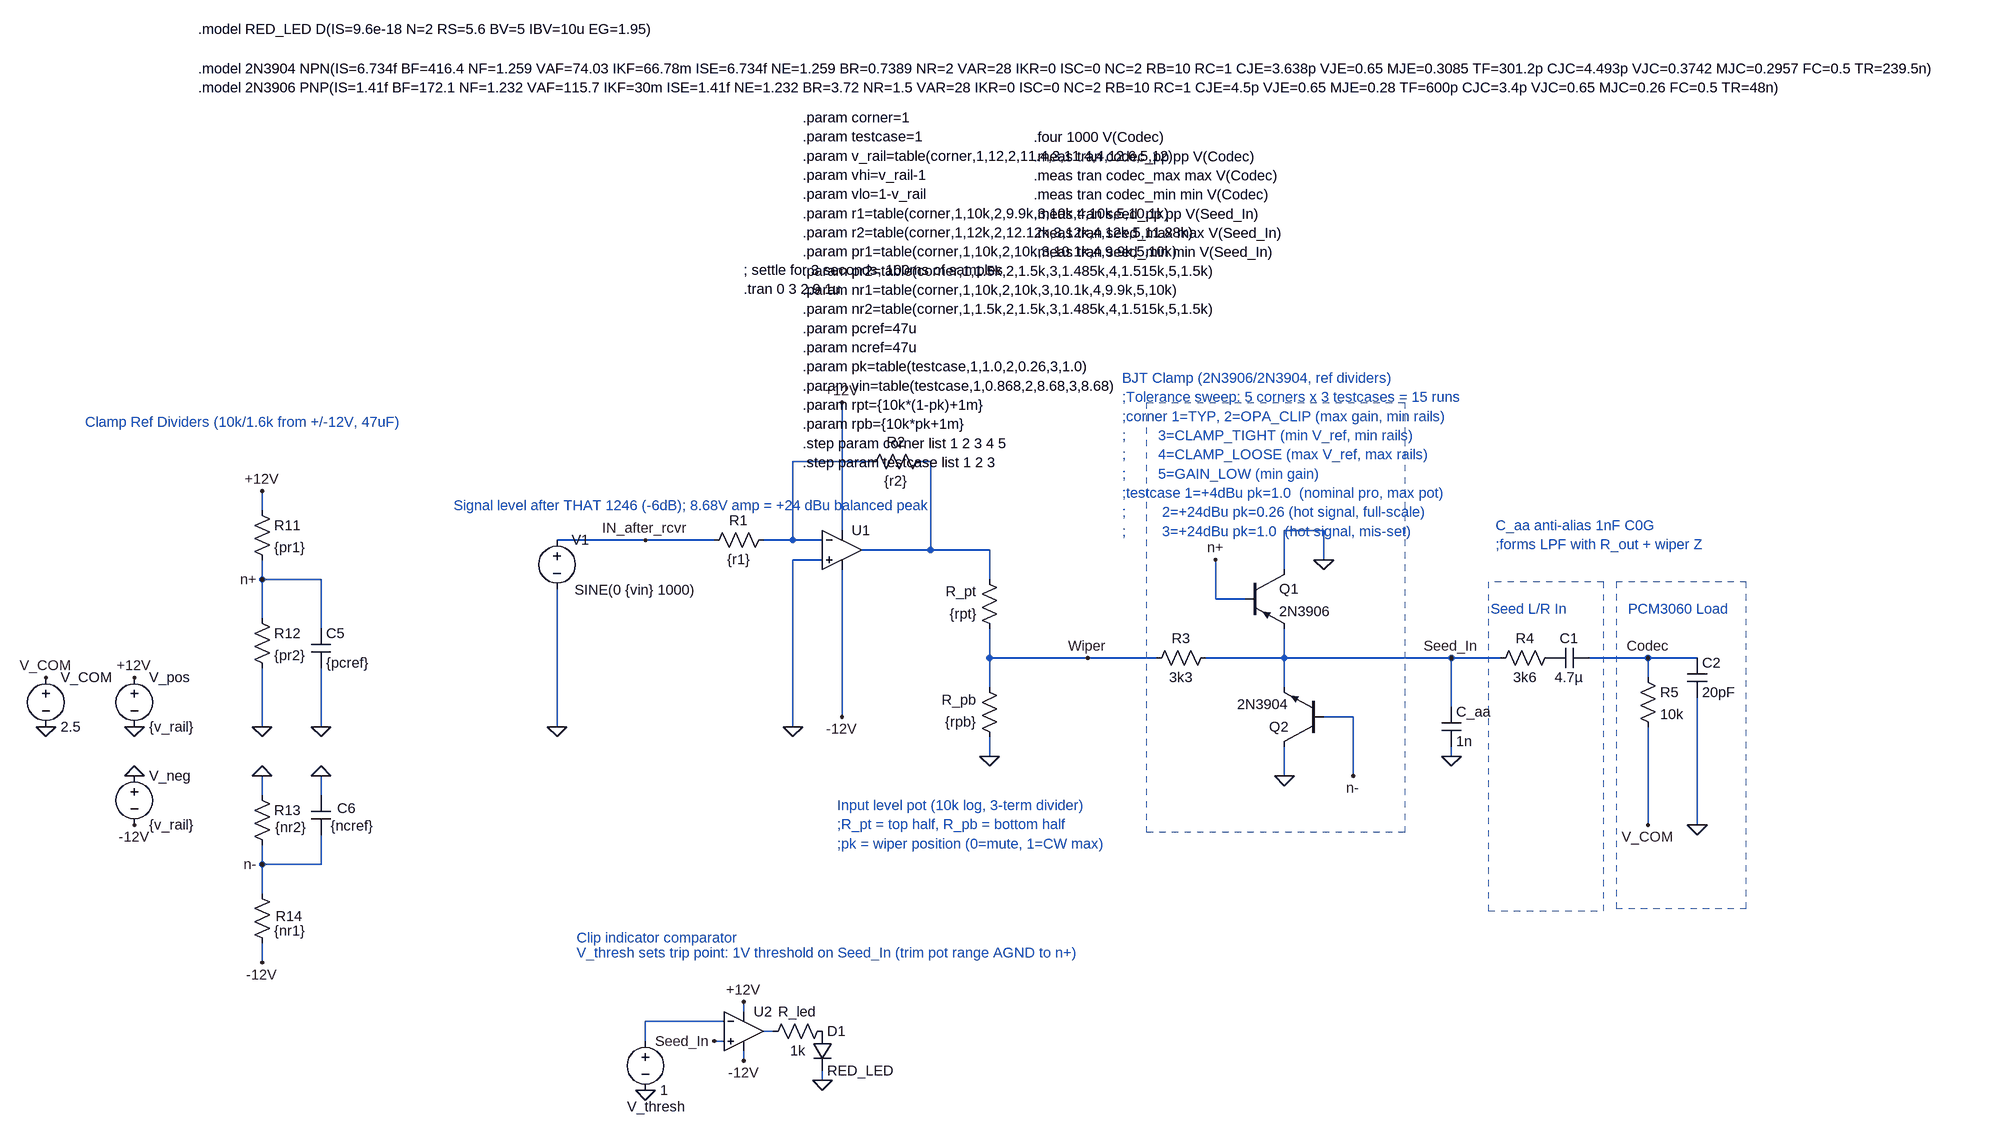
[diagram p0: schematic amp-atten-bjt-tolerance.asc]
amp-atten-bjt-tolerance.asc, the LTspice schematic file:
Version 4
SHEET 1 3124 2460
WIRE 608 576 480 576
WIRE 704 576 688 576
WIRE -384 656 -384 624
WIRE 560 688 560 480
WIRE 1344 688 1280 688
WIRE 240 704 96 704
WIRE 352 704 240 704
WIRE 480 704 480 576
WIRE 480 704 432 704
WIRE 528 704 480 704
WIRE 704 720 704 576
WIRE 704 720 592 720
WIRE 800 720 704 720
WIRE 528 736 480 736
WIRE 1344 736 1344 688
WIRE 1280 752 1280 688
WIRE -384 768 -384 736
WIRE -288 768 -384 768
WIRE 800 768 800 720
WIRE 1168 800 1168 736
WIRE 1216 800 1168 800
WIRE -384 832 -384 768
WIRE -288 848 -288 768
WIRE 800 896 800 848
WIRE 960 896 800 896
WIRE 1072 896 960 896
WIRE 1280 896 1280 848
WIRE 1280 896 1152 896
WIRE 1552 896 1280 896
WIRE 1632 896 1552 896
WIRE 1872 896 1776 896
WIRE 1952 896 1872 896
WIRE 1872 928 1872 896
WIRE 800 944 800 896
WIRE 1280 944 1280 896
WIRE 1552 976 1552 896
WIRE 560 992 560 752
WIRE 1392 992 1344 992
WIRE -384 1008 -384 912
WIRE -288 1008 -288 912
WIRE 96 1008 96 784
WIRE 480 1008 480 736
WIRE 800 1056 800 1024
WIRE 1552 1056 1552 1040
WIRE 1280 1088 1280 1040
WIRE 1392 1088 1392 992
WIRE -384 1120 -384 1088
WIRE -288 1120 -288 1088
WIRE 1872 1168 1872 1008
WIRE 1952 1168 1952 960
WIRE -384 1232 -384 1200
WIRE -288 1232 -288 1184
WIRE -288 1232 -384 1232
WIRE -384 1280 -384 1232
WIRE -384 1392 -384 1360
WIRE 400 1472 400 1456
WIRE 368 1488 240 1488
WIRE 448 1504 432 1504
WIRE 240 1520 240 1488
WIRE 368 1520 352 1520
WIRE 400 1552 400 1536
WIRE 528 1584 528 1568
FLAG -592 928 +12V
FLAG -592 1008 0
FLAG -592 1088 0
FLAG -592 1168 -12V
FLAG -384 624 +12V
FLAG -384 768 n+
FLAG -384 1008 0
FLAG -288 1008 0
FLAG -384 1088 0
FLAG -384 1232 n-
FLAG -384 1392 -12V
FLAG -288 1088 0
FLAG -736 928 V_COM
FLAG -736 1008 0
FLAG 96 1008 0
FLAG 240 704 IN_after_rcvr
FLAG 480 1008 0
FLAG 560 480 +12V
FLAG 560 992 -12V
FLAG 1552 896 Seed_In
FLAG 1872 896 Codec
FLAG 1872 1168 V_COM
FLAG 1952 1168 0
FLAG 1168 736 n+
FLAG 1344 736 0
FLAG 1392 1088 n-
FLAG 1280 1088 0
FLAG 352 1520 Seed_In
FLAG 240 1600 0
FLAG 400 1456 +12V
FLAG 400 1552 -12V
FLAG 528 1584 0
FLAG 960 896 Wiper
FLAG 1552 1056 0
FLAG 800 1056 0
SYMBOL voltage -592 912 R0
SYMATTR InstName V_pos
SYMATTR Value {v_rail}
SYMBOL voltage -592 1072 R0
SYMATTR InstName V_neg
SYMATTR Value {v_rail}
SYMBOL res -400 640 R0
SYMATTR InstName R11
SYMATTR Value {pr1}
SYMBOL res -400 816 R0
SYMATTR InstName R12
SYMATTR Value {pr2}
SYMBOL cap -304 848 R0
SYMATTR InstName C5
SYMATTR Value {pcref}
SYMBOL res -400 1104 R0
WINDOW 3 37 68 Left 2
SYMATTR Value {nr2}
SYMATTR InstName R13
SYMBOL res -400 1264 R0
WINDOW 0 38 53 Left 2
SYMATTR InstName R14
SYMATTR Value {nr1}
SYMBOL cap -304 1120 R0
WINDOW 0 42 21 Left 2
WINDOW 3 32 49 Left 2
SYMATTR InstName C6
SYMATTR Value {ncref}
SYMBOL voltage -736 912 R0
SYMATTR InstName V_COM
SYMATTR Value 2.5
SYMBOL voltage 96 688 R0
WINDOW 3 29 97 Left 2
SYMATTR Value SINE(0 {vin} 1000)
SYMATTR InstName V1
SYMATTR Value2 AC 1
SYMBOL res 336 720 R270
WINDOW 0 32 56 VTop 2
WINDOW 3 0 56 VBottom 2
SYMATTR InstName R1
SYMATTR Value {r1}
SYMBOL OpAmps/UniversalOpAmp2 560 720 R0
SYMATTR InstName U1
SYMATTR Value2 Avol=1Meg GBW=53Meg Slew=24Meg Vhigh={vhi} Vlow={vlo}
SYMBOL res 592 592 R270
WINDOW 0 32 56 VTop 2
WINDOW 3 0 56 VBottom 2
SYMATTR InstName R2
SYMATTR Value {r2}
SYMBOL res 1056 912 R270
WINDOW 0 32 56 VTop 2
WINDOW 3 0 56 VBottom 2
SYMATTR InstName R3
SYMATTR Value 3k3
SYMBOL pnp 1216 752 R0
SYMATTR InstName Q1
SYMATTR Value 2N3906
SYMBOL npn 1344 1040 R180
SYMATTR InstName Q2
SYMATTR Value 2N3904
SYMBOL res 1616 912 R270
WINDOW 0 32 56 VTop 2
WINDOW 3 0 56 VBottom 2
SYMATTR InstName R4
SYMATTR Value 3k6
SYMBOL cap 1776 880 R90
WINDOW 0 0 32 VBottom 2
WINDOW 3 32 32 VTop 2
SYMATTR InstName C1
SYMATTR Value 4.7µ
SYMBOL res 1856 912 R0
SYMATTR InstName R5
SYMATTR Value 10k
SYMBOL cap 1936 896 R0
SYMATTR InstName C2
SYMATTR Value 20pF
SYMBOL OpAmps/UniversalOpAmp2 400 1504 R0
SYMATTR InstName U2
SYMBOL voltage 240 1504 R0
WINDOW 0 -30 123 Left 2
SYMATTR InstName V_thresh
SYMATTR Value 1
SYMBOL res 432 1520 R270
WINDOW 0 32 56 VTop 2
WINDOW 3 0 56 VBottom 2
SYMATTR InstName R_led
SYMATTR Value 1k
SYMBOL diode 512 1504 R0
SYMATTR InstName D1
SYMATTR Value RED_LED
SYMBOL cap 1536 976 R0
SYMATTR InstName C_aa
SYMATTR Value 1n
SYMBOL Res 816 864 R180
WINDOW 0 36 76 Left 2
WINDOW 3 36 40 Left 2
SYMATTR InstName R_pt
SYMATTR Value {rpt}
SYMBOL Res 816 1040 R180
WINDOW 0 36 76 Left 2
WINDOW 3 36 40 Left 2
SYMATTR InstName R_pb
SYMATTR Value {rpb}
TEXT 400 264 Left 2 !; settle for 3 seconds, 100ms of samples\n.tran 0 3 2.9 1u
TEXT -488 -64 Left 2 !.model 2N3904 NPN(IS=6.734f BF=416.4 NF=1.259 VAF=74.03 IKF=66.78m ISE=6.734f NE=1.259 BR=0.7389 NR=2 VAR=28 IKR=0 ISC=0 NC=2 RB=10 RC=1 CJE=3.638p VJE=0.65 MJE=0.3085 TF=301.2p CJC=4.493p VJC=0.3742 MJC=0.2957 FC=0.5 TR=239.5n)\n.model 2N3906 PNP(IS=1.41f BF=172.1 NF=1.232 VAF=115.7 IKF=30m ISE=1.41f NE=1.232 BR=3.72 NR=1.5 VAR=28 IKR=0 ISC=0 NC=2 RB=10 RC=1 CJE=4.5p VJE=0.65 MJE=0.28 TF=600p CJC=3.4p VJC=0.65 MJC=0.26 FC=0.5 TR=48n)
TEXT -488 -128 Left 2 !.model RED_LED D(IS=9.6e-18 N=2 RS=5.6 BV=5 IBV=10u EG=1.95)
TEXT -72 648 Left 2 ;Signal level after THAT 1246 (-6dB); 8.68V amp = +24 dBu balanced peak
TEXT 1016 440 Left 2 ;BJT Clamp (2N3906/2N3904, ref dividers)\n;Tolerance sweep: 5 corners x 3 testcases = 15 runs\n;corner 1=TYP, 2=OPA_CLIP (max gain, min rails)\n;        3=CLAMP_TIGHT (min V_ref, min rails)\n;        4=CLAMP_LOOSE (max V_ref, max rails)\n;        5=GAIN_LOW (min gain)\n;testcase 1=+4dBu pk=1.0  (nominal pro, max pot)\n;         2=+24dBu pk=0.26 (hot signal, full-scale)\n;         3=+24dBu pk=1.0  (hot signal, mis-set)
TEXT 1616 816 Left 2 ;Seed L/R In
TEXT 1840 816 Left 2 ;PCM3060 Load
TEXT -672 512 Left 2 ;Clamp Ref Dividers (10k/1.6k from +/-12V, 47uF)
TEXT 496 16 Left 2 !.param corner=1\n.param testcase=1\n.param v_rail=table(corner,1,12,2,11.4,3,11.4,4,12.6,5,12)\n.param vhi=v_rail-1\n.param vlo=1-v_rail\n.param r1=table(corner,1,10k,2,9.9k,3,10k,4,10k,5,10.1k)\n.param r2=table(corner,1,12k,2,12.12k,3,12k,4,12k,5,11.88k)\n.param pr1=table(corner,1,10k,2,10k,3,10.1k,4,9.9k,5,10k)\n.param pr2=table(corner,1,1.5k,2,1.5k,3,1.485k,4,1.515k,5,1.5k)\n.param nr1=table(corner,1,10k,2,10k,3,10.1k,4,9.9k,5,10k)\n.param nr2=table(corner,1,1.5k,2,1.5k,3,1.485k,4,1.515k,5,1.5k)\n.param pcref=47u\n.param ncref=47u\n.param pk=table(testcase,1,1.0,2,0.26,3,1.0)\n.param vin=table(testcase,1,0.868,2,8.68,3,8.68)\n.param rpt={10k*(1-pk)+1m}\n.param rpb={10k*pk+1m}\n.step param corner list 1 2 3 4 5\n.step param testcase list 1 2 3
TEXT 872 48 Left 2 !.four 1000 V(Codec)\n.meas tran codec_pp pp V(Codec)\n.meas tran codec_max max V(Codec)\n.meas tran codec_min min V(Codec)\n.meas tran seed_pp pp V(Seed_In)\n.meas tran seed_max max V(Seed_In)\n.meas tran seed_min min V(Seed_In)
TEXT 128 1352 Left 2 ;Clip indicator comparator
TEXT 128 1376 Left 2 ;V_thresh sets trip point: 1V threshold on Seed_In (trim pot range AGND to n+)
TEXT 552 1136 Left 2 ;Input level pot (10k log, 3-term divider)\n;R_pt = top half, R_pb = bottom half\n;pk = wiper position (0=mute, 1=CW max)
TEXT 1624 680 Left 2 ;C_aa anti-alias 1nF C0G\n;forms LPF with R_out + wiper Z
RECTANGLE Normal 1820 1304 2032 772 2
RECTANGLE Normal 1612 1308 1800 772 2
RECTANGLE Normal 1476 1180 1056 480 2

The netlist it stands for:
* amp-atten-bjt-tolerance.asc
V_pos +12V 0 {v_rail}
V_neg 0 -12V {v_rail}
R11 +12V n+ {pr1}
R12 n+ 0 {pr2}
C5 n+ 0 {pcref}
R13 0 n- {nr2}
R14 n- -12V {nr1}
C6 0 n- {ncref}
V_COM V_COM 0 2.5
V1 IN_after_rcvr 0 SINE(0 {vin} 1000) AC 1
R1 IN_after_rcvr N001 {r1}
XU1 0 N001 +12V -12V N002 level2 Avol=1Meg GBW=53Meg Slew=24Meg Vhigh={vhi} Vlow={vlo} Ilimit=25m Rail=0 Vos=0 En=0 Enk=0 In=0 Ink=0 Rin=500Meg  ; pins In+ In- V+ V- OUT
R2 N001 N002 {r2}
R3 Wiper Seed_In 3k3
Q1 0 n+ Seed_In 0 2N3906
Q2 0 n- Seed_In 0 2N3904
R4 Seed_In P001 3k6
C1 Codec P001 4.7µ
R5 Codec V_COM 10k
C2 Codec 0 20pF
XU2 Seed_In N003 +12V -12V N004 level2 Avol=1Meg GBW=10Meg Slew=10Meg Ilimit=25m Rail=0 Vos=0 En=0 Enk=0 In=0 Ink=0 Rin=500Meg  ; pins In+ In- V+ V- OUT
V_thresh N003 0 1
R_led N004 P002 1k
D1 P002 0 RED_LED
C_aa Seed_In 0 1n
R_pt Wiper N002 {rpt}
R_pb 0 Wiper {rpb}
.model D D
.lib standard.dio
.model NPN NPN
.model PNP PNP
.lib standard.bjt
; settle for 3 seconds, 100ms of samples
.tran 0 3 2.9 1u
.model 2N3904 NPN(IS=6.734f BF=416.4 NF=1.259 VAF=74.03 IKF=66.78m ISE=6.734f NE=1.259 BR=0.7389 NR=2 VAR=28 IKR=0 ISC=0 NC=2 RB=10 RC=1 CJE=3.638p VJE=0.65 MJE=0.3085 TF=301.2p CJC=4.493p VJC=0.3742 MJC=0.2957 FC=0.5 TR=239.5n)
.model 2N3906 PNP(IS=1.41f BF=172.1 NF=1.232 VAF=115.7 IKF=30m ISE=1.41f NE=1.232 BR=3.72 NR=1.5 VAR=28 IKR=0 ISC=0 NC=2 RB=10 RC=1 CJE=4.5p VJE=0.65 MJE=0.28 TF=600p CJC=3.4p VJC=0.65 MJC=0.26 FC=0.5 TR=48n)
.model RED_LED D(IS=9.6e-18 N=2 RS=5.6 BV=5 IBV=10u EG=1.95)
* Signal level after THAT 1246 (-6dB); 8.68V amp = +24 dBu balanced peak
* BJT Clamp (2N3906/2N3904, ref dividers)
* ;Tolerance sweep: 5 corners x 3 testcases = 15 runs
* ;corner 1=TYP, 2=OPA_CLIP (max gain, min rails)
* ;        3=CLAMP_TIGHT (min V_ref, min rails)
* ;        4=CLAMP_LOOSE (max V_ref, max rails)
* ;        5=GAIN_LOW (min gain)
* ;testcase 1=+4dBu pk=1.0  (nominal pro, max pot)
* ;         2=+24dBu pk=0.26 (hot signal, full-scale)
* ;         3=+24dBu pk=1.0  (hot signal, mis-set)
* Seed L/R In
* PCM3060 Load
* Clamp Ref Dividers (10k/1.6k from +/-12V, 47uF)
.param corner=1
.param testcase=1
.param v_rail=table(corner,1,12,2,11.4,3,11.4,4,12.6,5,12)
.param vhi=v_rail-1
.param vlo=1-v_rail
.param r1=table(corner,1,10k,2,9.9k,3,10k,4,10k,5,10.1k)
.param r2=table(corner,1,12k,2,12.12k,3,12k,4,12k,5,11.88k)
.param pr1=table(corner,1,10k,2,10k,3,10.1k,4,9.9k,5,10k)
.param pr2=table(corner,1,1.5k,2,1.5k,3,1.485k,4,1.515k,5,1.5k)
.param nr1=table(corner,1,10k,2,10k,3,10.1k,4,9.9k,5,10k)
.param nr2=table(corner,1,1.5k,2,1.5k,3,1.485k,4,1.515k,5,1.5k)
.param pcref=47u
.param ncref=47u
.param pk=table(testcase,1,1.0,2,0.26,3,1.0)
.param vin=table(testcase,1,0.868,2,8.68,3,8.68)
.param rpt={10k*(1-pk)+1m}
.param rpb={10k*pk+1m}
.step param corner list 1 2 3 4 5
.step param testcase list 1 2 3
.four 1000 V(Codec)
.meas tran codec_pp pp V(Codec)
.meas tran codec_max max V(Codec)
.meas tran codec_min min V(Codec)
.meas tran seed_pp pp V(Seed_In)
.meas tran seed_max max V(Seed_In)
.meas tran seed_min min V(Seed_In)
* Clip indicator comparator
* V_thresh sets trip point: 1V threshold on Seed_In (trim pot range AGND to n+)
* Input level pot (10k log, 3-term divider)
* ;R_pt = top half, R_pb = bottom half
* ;pk = wiper position (0=mute, 1=CW max)
* C_aa anti-alias 1nF C0G
* ;forms LPF with R_out + wiper Z
.lib UniversalOpAmp2.lib
.backanno
.end